# Altium schematic sheet buck_boost.SchDoc
size A; SheetNumber: 3; SheetTotal: 3
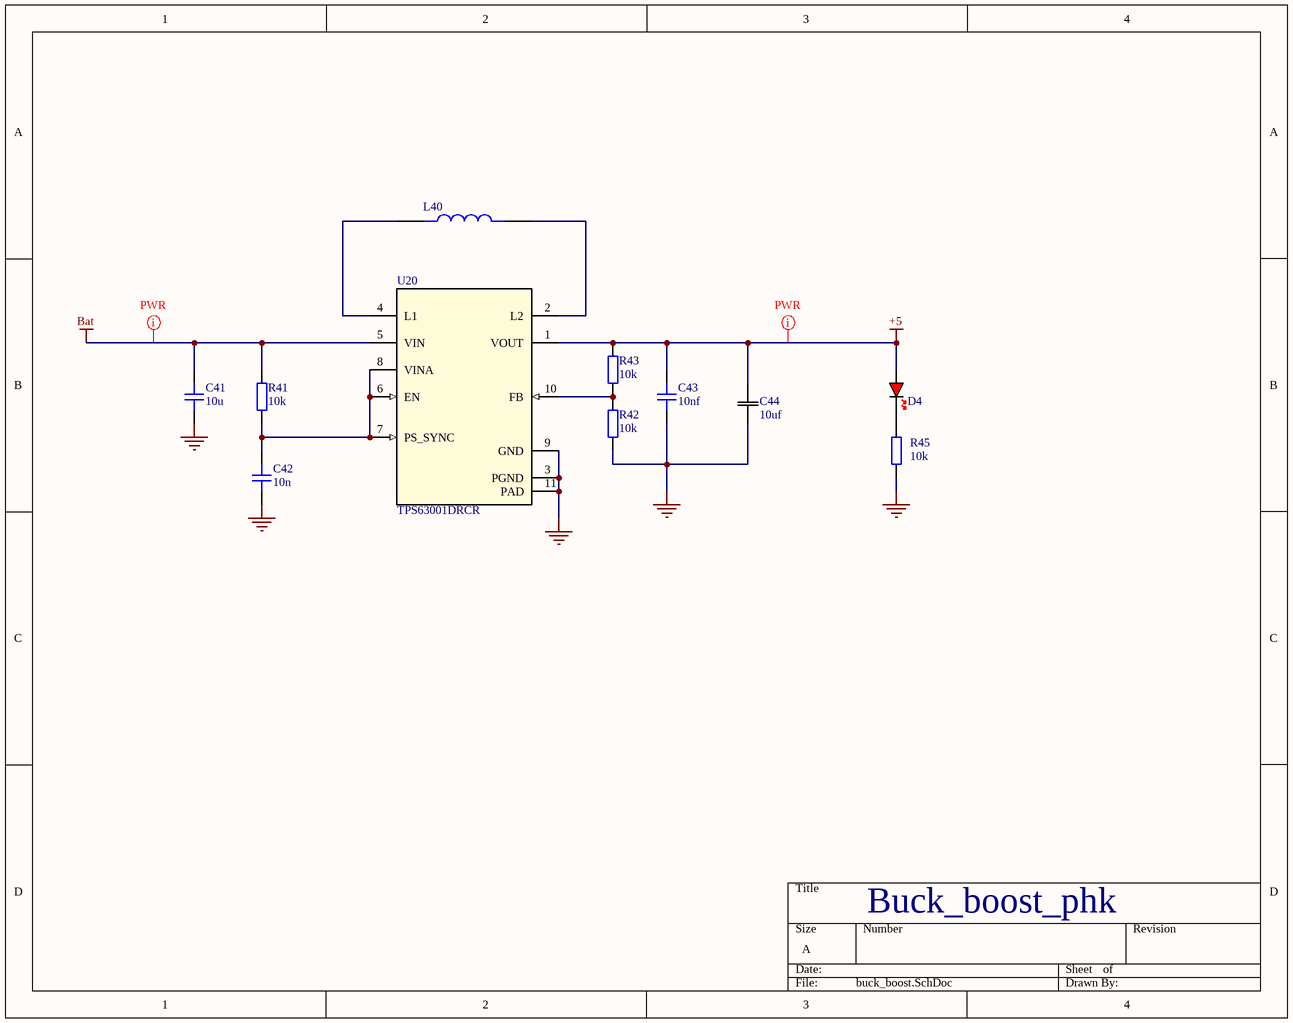
[diagram p0: buck_boost.SchDoc]

## Parts
C41  10u  [CAP_0603]
C42  10n  [CAP_0402]
C43  10nf  [CAP_0603]
C44  10uf  [CAP_FN_B_PAN]
D4  RED  [LED_0402_RED]  (value not drawn)
L40  VLS3012ET-2R2M  [IND_VLS3012ET-2R2M]  (value not drawn)
R41  10k  [RES_0402]
R42  10k  [RES_0402]
R43  10k  [RES_0402]
R45  10k  [RES_0402]
U20  TPS63001DRCR  [DRC0010J]

## Nets
+5: C43.2 C44.2 D4.A R43.2 U20.1(VOUT)
Bat: C41.2 R41.2 U20.5(VIN)
GND: C41.1 C42.1 C43.1 C44.1 R42.1 R45.1 U20.3(PGND) U20.9(GND) U20.11(PAD)
NetC42_2: C42.2 R41.1 U20.6(EN) U20.7(PS_SYNC) U20.8(VINA)
NetD4_K: D4.K R45.2
NetL40_1: L40.1 U20.4(L1)
NetL40_2: L40.2 U20.2(L2)
NetR42_2: R42.2 R43.1 U20.10(FB)

## Layout directives
mark named PWR: +5, Bat

## Notes on the sheet
- Buck_boost_phk

## Library data of the parts
C41 C43 = CAP_0603: Capacitor SMD 0603; Manufacturer: *; Manufacturer Part Number: *; Distributor Link: *; LCSC: *; Rating: *; Dielectric: *
C42 = CAP_0402: Capacitor SMD 0402; Manufacturer: *; Manufacturer Part Number: *; Distributor Link: *; LCSC: *; Rating: *; Dielectric: *
C44 = EEE-FN0J100R: No Description Available; Manufacturer_Name: Panasonic; Copyright: Copyright (C) 2026 Ultra Librarian. All rights reserved.; Manufacturer_Part_Number: EEE-FN0J100R
D4 = LED_0402_RED: LED 0402 RED SMD
L40 = VLS3012ET-2R2M: 2.2 ÂµH Shielded Drum Core, Wirewound Inductor 1.35 A 96mOhm Max Nonstandard; MF: TDK; Package: NON STANDARD-2 TDK; Digi-Key_Part_Number: 445-6664-2-ND; Purchase-URL: https://pricing.snapeda.com/search/part/VLS3012ET-2R2M/?ref=eda; Check_prices: https://www.snapeda.com/parts/VLS3012ET-2R2M/TDK/view-part/?ref=eda; MP: VLS3012ET-2R2M; SnapEDA_Link: https://www.snapeda.com/parts/VLS3012ET-2R2M/TDK/view-part/?ref=snap; Value: *
R41-R43 R45 = RES_0402: Resistor SMD 0402; Manufacturer: *; Manufacturer Part Number: *; Distributor Link: *; LCSC: *
U20 = TPS63001DRCR: 96% Buck-Boost Converter with 1.7A Current Switches, 3.3V fixed Output voltage in 3x3 QFN 10-VSON -40 to 125; Manufacturer_Name: Texas Instruments; Alternate_PartNumber: TPS63001DRCT; CompType: IC; TYPE: TYPE; RefDes: RefDes; Copyright: Copyright (C) 2025 Ultra Librarian. All rights reserved.; Manufacturer_Part_Number: TPS63001DRCR; Application_BuildNumber: *; PartNumber: TPS63001DRCR; PackageReference: DRC0010J; MountType: SMT; RoHS: Y; Manufacturer: Texas Instruments